# EAGLE design WeatherShield_Base (EAGLE 7.4.0)
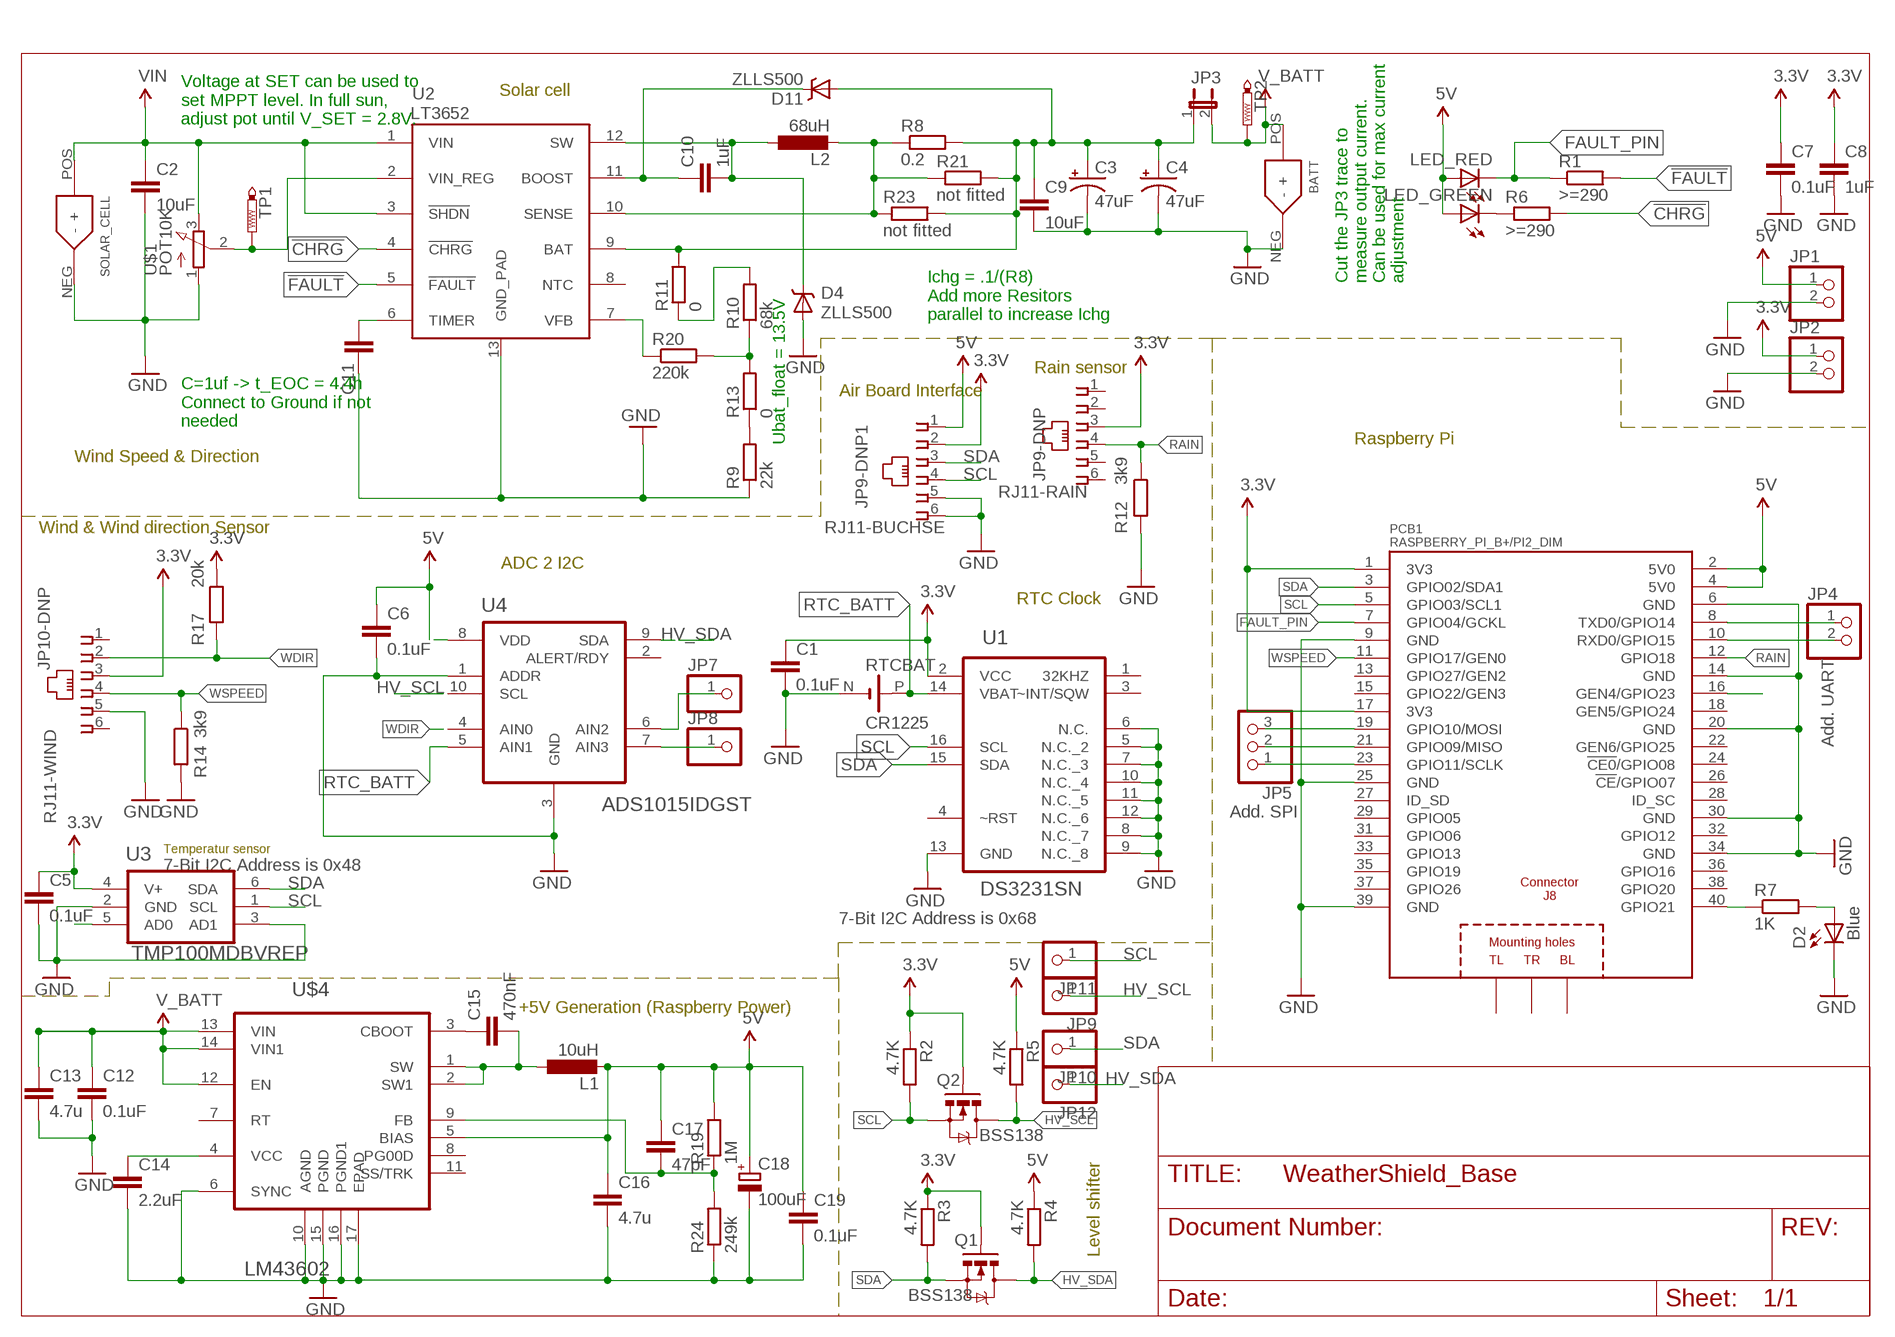
[diagram p0: schematic, sheet 1]

## Parts
BATT  XT-60  [XT-60]
C1  0.1uF  C-EUC0603  [C0603]
C2  10uF  C-EUC0603  [C0603]
C3  47uF  47UF-16V-10%(TANT)  [EIA7343-20]
C4  47uF  47UF-16V-10%(TANT)  [EIA7343-20]
C5  0.1uF  C-EUC0603  [C0603]
C6  0.1uF  C-EUC0603  [C0603]
C7  0.1uF  C-EUC0603  [C0603]
C8  1uF  C-EUC0603  [C0603]
C9  10uF  C-EUC0603  [C0603]
C10  1uF  C-EUC0603  [C0603]
C11  1.0uF  C-EUC0603  [C0603]
C12  0.1uF  C-EUC1206  [C1206]
C13  4.7u  C-EUC1206  [C1206]
C14  2.2uF  C-EUC0603  [C0603]
C15  470nF  C-EUC0603  [C0603]
C16  4.7u  C-EUC0603  [C0603]
C17  47pF  C-EUC0603  [C0603]
C18  100uF  CPOL-EUE2,5-6E  [E2,5-6E]
C19  0.1uF  C-EUC1206  [C1206]
D2  Blue  LED0603  [LED-0603]
D4  ZLLS500  ZLLS500ZLLS500  [SOT23]
D11  ZLLS500  ZLLS500ZLLS500  [SOT23]
JP1  PINHD-1X2  [1X02]
JP2  PINHD-1X2  [1X02]
JP3  JUMPER-PTH-2-NC  [PTH-JUMPER-NC_BOTTOM_NO_SILK]
JP4  PINHD-1X2  [1X02]
JP5  PINHD-1X3  [1X03]
JP7  PINHD-1X1  [1X01]
JP8  PINHD-1X1  [1X01]
JP9  PINHD-1X1  [1X01]
JP9-DNP  RJ11-RAIN  RJ11-BUCHSE  [RJ11-STECKER]
JP9-DNP1  RJ11-BUCHSE  [RJ11-STECKER]
JP10  PINHD-1X1  [1X01]
JP10-DNP  RJ11-WIND  RJ11-BUCHSE  [RJ11-STECKER]
JP11  PINHD-1X1  [1X01]
JP12  PINHD-1X1  [1X01]
L1  10uH  L-EU6000-XXX-RC  [6000-XXXX-RC]
L2  68uH  L-EU6000-XXX-RC  [6000-XXXX-RC]
LED_GREEN  LEDSML0603  [SML0603]
LED_RED  LEDSML0603  [SML0603]
PCB1  RASPBERRY_PI_B+/PI2_DIM  [RASPBERRY_PI_BPLUS_DIM]
Q1  BSS138  MOSFET-NCHANNELSMD  [SOT23-3]
Q2  BSS138  MOSFET-NCHANNELSMD  [SOT23-3]
R1  >=290  R-EU_R0603  [R0603]
R2  4.7K  R-EU_R0603  [R0603]
R3  4.7K  R-EU_R0603  [R0603]
R4  4.7K  R-EU_R0603  [R0603]
R5  4.7K  R-EU_R0603  [R0603]
R6  >=290  R-EU_R0603  [R0603]
R7  1K  R-EU_R0603  [R0603]
R8  0.2  R-EU_R0805  [R0805]
R9  22k  R-EU_R0603  [R0603]
R10  68k  R-EU_R0603  [R0603]
R11  0  R-EU_R0603  [R0603]
R12  3k9  R-EU_R0603  [R0603]
R13  0  R-EU_R0603  [R0603]
R14  3k9  R-EU_R0603  [R0603]
R17  20k  R-EU_R0603  [R0603]
R19  1M  R-EU_R0805  [R0805]
R20  220k  R-EU_R0603  [R0603]
R21  not fitted  R-EU_R0805  [R0805]
R23  not fitted  R-EU_R0805  [R0805]
R24  249k  R-EU_R0805  [R0805]
RTCBAT  CR1225  BATTERIE_HALTER_CR1225  [BATTERIE_HALTER_CR1225]
SOLAR_CELL  XT-60  [XT-60]
TP1  SET  PTR1B1,27  [B1,27]
TP2  SET  PTR1B1,27  [B1,27]
U1  DS3231SN  [SOIC127P1032X265-16N]
U2  LT3652  [MSOP-12_GND]
U3  TMP100MDBVREP  [SOT95P280X145-6N]
U4  ADS1015IDGST  [SOP50P490X110-10N]
U$1  POT10K  POT_TS63Y_10K  [POT_TS63Y_10K]
U$4  LM43602  [HTSSOP-16]

## Nets
3.3V: C1.1 C5.1 C7.1 C8.1 JP2.1 JP9-DNP1.2 JP9-DNP.3 JP10-DNP.3 PCB1.1(3V3) PCB1.17(3V3) Q1.1(G) Q2.1(G) R2.1 R3.1 R17.1 U1.2(VCC) U3.4(V+)
5V: C6.1 C16.1 C17.1 C18.+ C19.1 JP1.1 JP9-DNP1.1 L1.2 LED_GREEN.A LED_RED.A PCB1.2(5V0) PCB1.4(5V0) R4.1 R5.1 R19.2 U4.8(VDD) U$4.5(BIAS)
!CHRG: R6.2 U2.4(!CHRG)
!FAULT: R1.2 U2.5(!FAULT)
BOOST: C10.1 D11.3(C) U2.11(BOOST)
FAULT_PIN: LED_RED.C PCB1.7(GPIO04/GCKL) R1.1
FB: R10.1 R13.2 R20.2
GND [vcc]: BATT.NEG(-) C1.2 C2.2 C3.C(-) C4.C(-) C5.2 C6.2 C7.2 C8.2 C9.2 C11.1 C12.2 C13.2 C14.2 C16.2 C18.- C19.2 D2.C D4.1(A) JP1.2 JP2.2 JP9-DNP1.5 JP9-DNP1.6 JP10-DNP.5 PCB1.6(GND) PCB1.9(GND) PCB1.14(GND) PCB1.20(GND) PCB1.25(GND) PCB1.30(GND) PCB1.34(GND) PCB1.39(GND) R9.1 R12.2 R14.2 R24.1 RTCBAT.N(-) SOLAR_CELL.NEG(-) U1.5(N.C._2) U1.6(N.C.) U1.7(N.C._3) U1.8(N.C._7) U1.9(N.C._8) U1.10(N.C._4) U1.11(N.C._5) U1.12(N.C._6) U1.13(GND) U2.13(GND_PAD) U3.2(GND) U3.3(AD1) U4.1(ADDR) U4.3(GND) U$1.1(A) U$4.6(SYNC) U$4.10(AGND) U$4.15(PGND) U$4.16(PGND1) U$4.17(EPAD)
HV_SCL: JP9.1 Q2.3(D) R5.2 U4.10(SCL)
HV_SDA: JP12.1 Q1.3(D) R4.2 U4.9(SDA)
N$1: R9.2 R13.1
N$2: R10.2 R11.1
N$3: PCB1.16(GEN4/GPIO23)
N$4: LED_GREEN.C R6.1
N$5: U3.5(AD0)
N$8: JP7.1 U4.6(AIN2)
N$9: JP8.1 U4.7(AIN3)
N$10: D2.A R7.2
N$15: R20.1 U2.7(VFB)
N$16: C3.A(+) C4.A(+) C9.1 D11.1(A) JP3.1 R8.2 R11.2 R21.2 R23.2 U2.9(BAT)
N$17: C15.1 U$4.3(CBOOT)
N$18: JP4.1 PCB1.8(TXD0/GPIO14)
N$19: JP4.2 PCB1.10(RXD0/GPIO15)
N$20: JP5.3 PCB1.19(GPIO10/MOSI)
N$21: JP5.2 PCB1.21(GPIO09/MISO)
N$22: C17.2 R19.1 R24.2 U$4.9(FB)
N$23: C14.1 U$4.4(VCC)
N$24: C15.2 L1.1 U$4.1(SW) U$4.2(SW1)
N$25: JP5.1 PCB1.23(GPIO11/SCLK)
RAIN: JP9-DNP.4 PCB1.12(GPIO18) R12.1
RTC_BATT: RTCBAT.P(+) U1.14(VBAT) U4.5(AIN1)
SCL: JP9-DNP1.4 JP11.1 PCB1.5(GPIO03/SCL1) Q2.2(S) R2.2 U1.16(SCL) U3.1(SCL)
SDA: JP9-DNP1.3 JP10.1 PCB1.3(GPIO02/SDA1) Q1.2(S) R3.2 U1.15(SDA) U3.6(SDA)
SENSE: L2.2 R8.1 R21.1 R23.1 U2.10(SENSE)
SET: TP1.TP U2.2(VIN_REG) U$1.2(S)
STAT3: PCB1.40(GPIO21) R7.1
SW: C10.2 D4.3(C) L2.1 U2.12(SW)
TIMER: C11.2 U2.6(TIMER)
V_BATT: BATT.POS(+) C12.1 C13.1 JP3.2 TP2.TP U$4.12(EN) U$4.13(VIN) U$4.14(VIN1)
VIN: C2.1 SOLAR_CELL.POS(+) U2.1(VIN) U2.3(!SHDN) U$1.3(E)
WDIR: JP10-DNP.2 R17.2 U4.4(AIN0)
WSPEED: JP10-DNP.4 PCB1.11(GPIO17/GEN0) R14.1
Unconnected: JP9-DNP.1 JP9-DNP.2 JP9-DNP.5 JP9-DNP.6 JP10-DNP.1 JP10-DNP.6 PCB1.13(GPIO27/GEN2) PCB1.15(GPIO22/GEN3) PCB1.18(GEN5/GPIO24) PCB1.22(GEN6/GPIO25) PCB1.24(!CE0!/GPIO08) PCB1.26(!CE!/GPIO07) PCB1.27(ID_SD) PCB1.28(ID_SC) PCB1.29(GPIO05) PCB1.31(GPIO06) PCB1.32(GPIO12) PCB1.33(GPIO13) PCB1.35(GPIO19) PCB1.36(GPIO16) PCB1.37(GPIO26) PCB1.38(GPIO20) PCB1.PE_BL(BL) PCB1.PE_TL(TL) PCB1.PE_TR(TR) U1.1(32KHZ) U1.3(~INT/SQW) U1.4(~RST) U2.8(NTC) U4.2(ALERT/RDY) U$4.7(RT) U$4.8(PG00D) U$4.11(SS/TRK)

## Notes on the sheet
- Solar cell
- Voltage at SET can be used to
  set MPPT level. In full sun,
  adjust pot until V_SET = 2.8V.
- Cut the JP3 trace to
  measure output current.
  Can be used for max current
  adjustment
- Ichg = .1/(R8)
  Add more Resitors 
  parallel to increase Ichg
- Rain sensor
- Air Board Interface
- C=1uf -> t_EOC = 4.4h
  Connect to Ground if not 
  needed
- Ubat_float = 13.5V | Raspberry Pi
- Wind Speed & Direction
- Wind & Wind direction Sensor
- ADC 2 I2C
- RTC Clock
- Add. UART
- Add. SPI
- Temperatur sensor
- 7-Bit I2C Address is 0x48
- 7-Bit I2C Address is 0x68
- +5V Generation (Raspberry Power)
- Level shifter

## Library data of the parts
BATT SOLAR_CELL = FSEWeatherShield:XT-60
C1 C2 C5-C17 C19 = rcl:C-EU: CAPACITOR, European symbol
C3 C4 = FSEWeatherShield:47UF-16V-10%(TANT)
C18 = rcl:CPOL-EU: POLARIZED CAPACITOR, European symbol
D2 = SparkFun:LED: LEDs Standard schematic elements and footprints for 5mm, 3mm, 1206, and 0603 sized LEDs. 5mm - Spark Fun Electronics SKU : COM-00529 (and others)
D4 D11 = SparkFun-DiscreteSemi:ZLLS500: 700mA 40V SOT-23 Schottky; PROD_ID: DIO-08411
JP1 JP2 JP4 = pinhead:PINHD-1X2: PIN HEADER
JP3 = SparkFun-Passives:JUMPER-PTH-2-NC
JP5 = pinhead:PINHD-1X3: PIN HEADER
JP7-JP12 = pinhead:PINHD-1X1: PIN HEADER
JP9-DNP JP9-DNP1 JP10-DNP = FSEWeatherShield:RJ11-BUCHSE
L1 L2 = rcl:L-EU: INDUCTOR, European symbol
LED_GREEN LED_RED = led:LED: LED OSRAM: - CHIPLED LG R971, LG N971, LY N971, LG Q971, LY Q971, LO R971, LY R971 LH N974, LH R974 LS Q976, LO Q976, LY Q976 LO Q996 - Hyper CHIPLED LW Q18S LB Q993, LB Q99A, LB R99A - SideLED LS A670, LO A670, LY A670, LG A670, LP A670 LB A673, LV A673, LT A673, LW A673 LH A674 LY A675 LS A676, LA A676, LO A676, LY A676, LW A676 LS A679, LY A679, LG A679 - Hyper Micro SIDELED® LS Y876, LA Y876, LO Y876, LY Y876 LT Y87S - SmartLED LW L88C, LW L88S LB L89C, LB L89S, LG L890 LS L89K, LO L89K, LY L89K LS L896, LA L896, LO L896, LY L896 - TOPLED LS T670, LO T670, LY T670, LG T670, LP T670 LSG T670, LSP T670, LSY T670, LOP T670, LYG T670 LG T671, LOG T671, LSG T671 LB T673, LV T673, LT T673, LW T673 LH T674 LS T676, LA T676, LO T676, LY T676, LB T676, LH T676, LSB T676, LW T676 LB T67C, LV T67C, LT T67C, LS T67K, LO T67K, LY T67K, LW E67C LS E67B, LA E67B, LO E67B, LY E67B, LB E67C, LV E67C, LT E67C LW T67C LS T679, LY T679, LG T679 LS T770, LO T770, LY T770, LG T770, LP T770 LB T773, LV T773, LT T773, LW T773 LH T774 LS E675, LA E675, LY E675, LS T675 LS T776, LA T776, LO T776, LY T776, LB T776 LHGB T686 LT T68C, LB T68C - Hyper Mini TOPLED® LB M676 - Mini TOPLED Santana® LG M470 LS M47K, LO M47K, LY M47K Source: http://www.osram.convergy.de LUXEON: - LUMILED® LXK2-PW12-R00, LXK2-PW12-S00, LXK2-PW14-U00, LXK2-PW14-V00 LXK2-PM12-R00, LXK2-PM12-S00, LXK2-PM14-U00 LXK2-PE12-Q00, LXK2-PE12-R00, LXK2-PE12-S00, LXK2-PE14-T00, LXK2-PE14-U00 LXK2-PB12-K00, LXK2-PB12-L00, LXK2-PB12-M00, LXK2-PB14-N00, LXK2-PB14-P00, LXK2-PB14-Q00 LXK2-PR12-L00, LXK2-PR12-M00, LXK2-PR14-Q00, LXK2-PR14-R00 LXK2-PD12-Q00, LXK2-PD12-R00, LXK2-PD12-S00 LXK2-PH12-R00, LXK2-PH12-S00 LXK2-PL12-P00, LXK2-PL12-Q00, LXK2-PL12-R00 Source: www.luxeon.com KINGBRIGHT: KA-3528ASYC Source: www.kingbright.com
PCB1 = FSE_Weather_Shield:RASPBERRY_PI_B+/PI2: Raspberry Pi B+ Basedon issue: Thursday, July 10, 2014 - Rev 1.2 LBR by Tim Rettmann 07-2014
Q1 Q2 = SparkFun:MOSFET-NCHANNEL
R1-R14 R17 R19-R21 R23 R24 = rcl:R-EU_: RESISTOR, European symbol
RTCBAT = FSEWeatherShield:BATTERIE_HALTER_CR1225
TP1 TP2 = testpad:PTR1: TEST PIN
U1 = FSE_Weather_Shield:DS3231SN: Extremely Accurate I2C-Integrated RTC/TCXO/Crystal; MPN: DS3231SN#; OC_FARNELL: 1593292; OC_NEWARK: 68K3406; PACKAGE: SOIC-16; SUPPLIER: Maxim
U2 = SparkFun-PowerIC:LT3652: LT3652 MPPT Solar Charge Controller 5V-32V smart charger for batteries up to 14.4V
U3 = FSEWeatherShield:TMP100MDBVREP: DIGITAL TEMPERATURE SENSOR WITH I2C INTERFACE; MPN: TMP100MDBVREP; OC_FARNELL: 1715202; OC_NEWARK: 46M1069; PACKAGE: SOT-23-6; SUPPLIER: Texas Instruments
U4 = FSEWeatherShield:ADS1015IDGST: Ultra-Small, Low-Power, 12-Bit Analog-to-Digital Converter with Internal Reference; MPN: ADS1015IDGST; OC_FARNELL: 1778211; OC_NEWARK: 35R0211; PACKAGE: MSOP-10; SUPPLIER: Texas Instruments
U$1 = FSEWeatherShield:POT_TS63Y_10K
U$4 = FSEWeatherShield:LM43602

## Net classes
1 vcc: width 0.203 mm

## Board
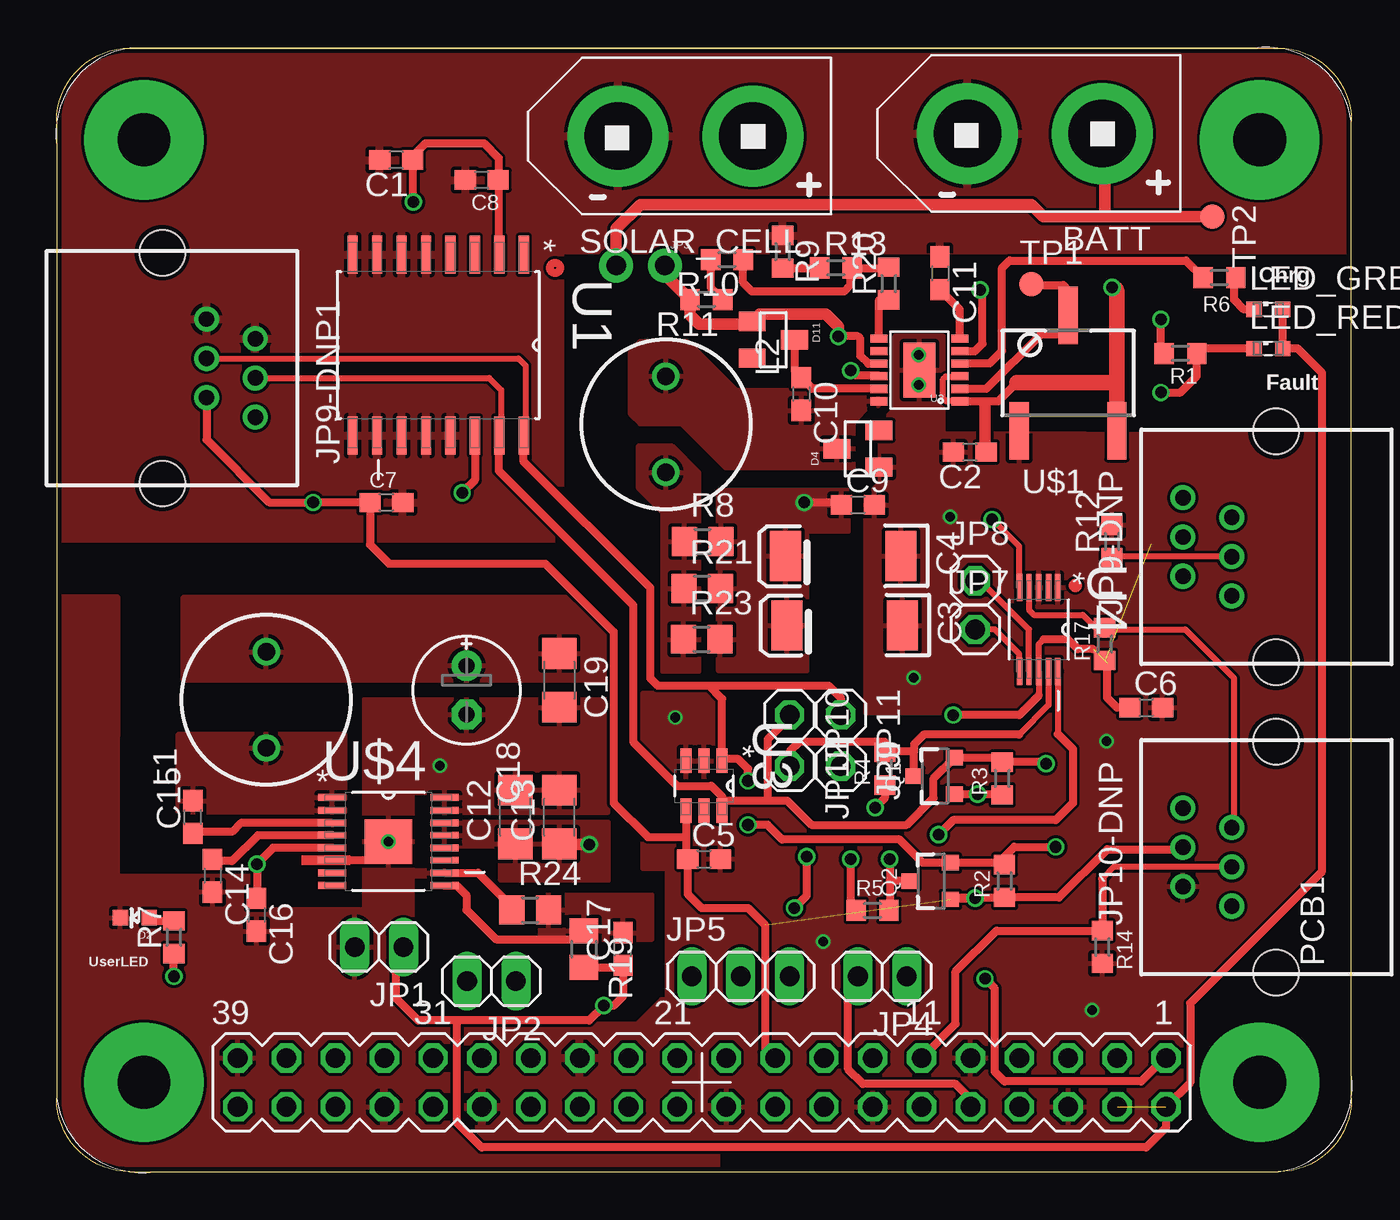
[diagram p1: board, top side]
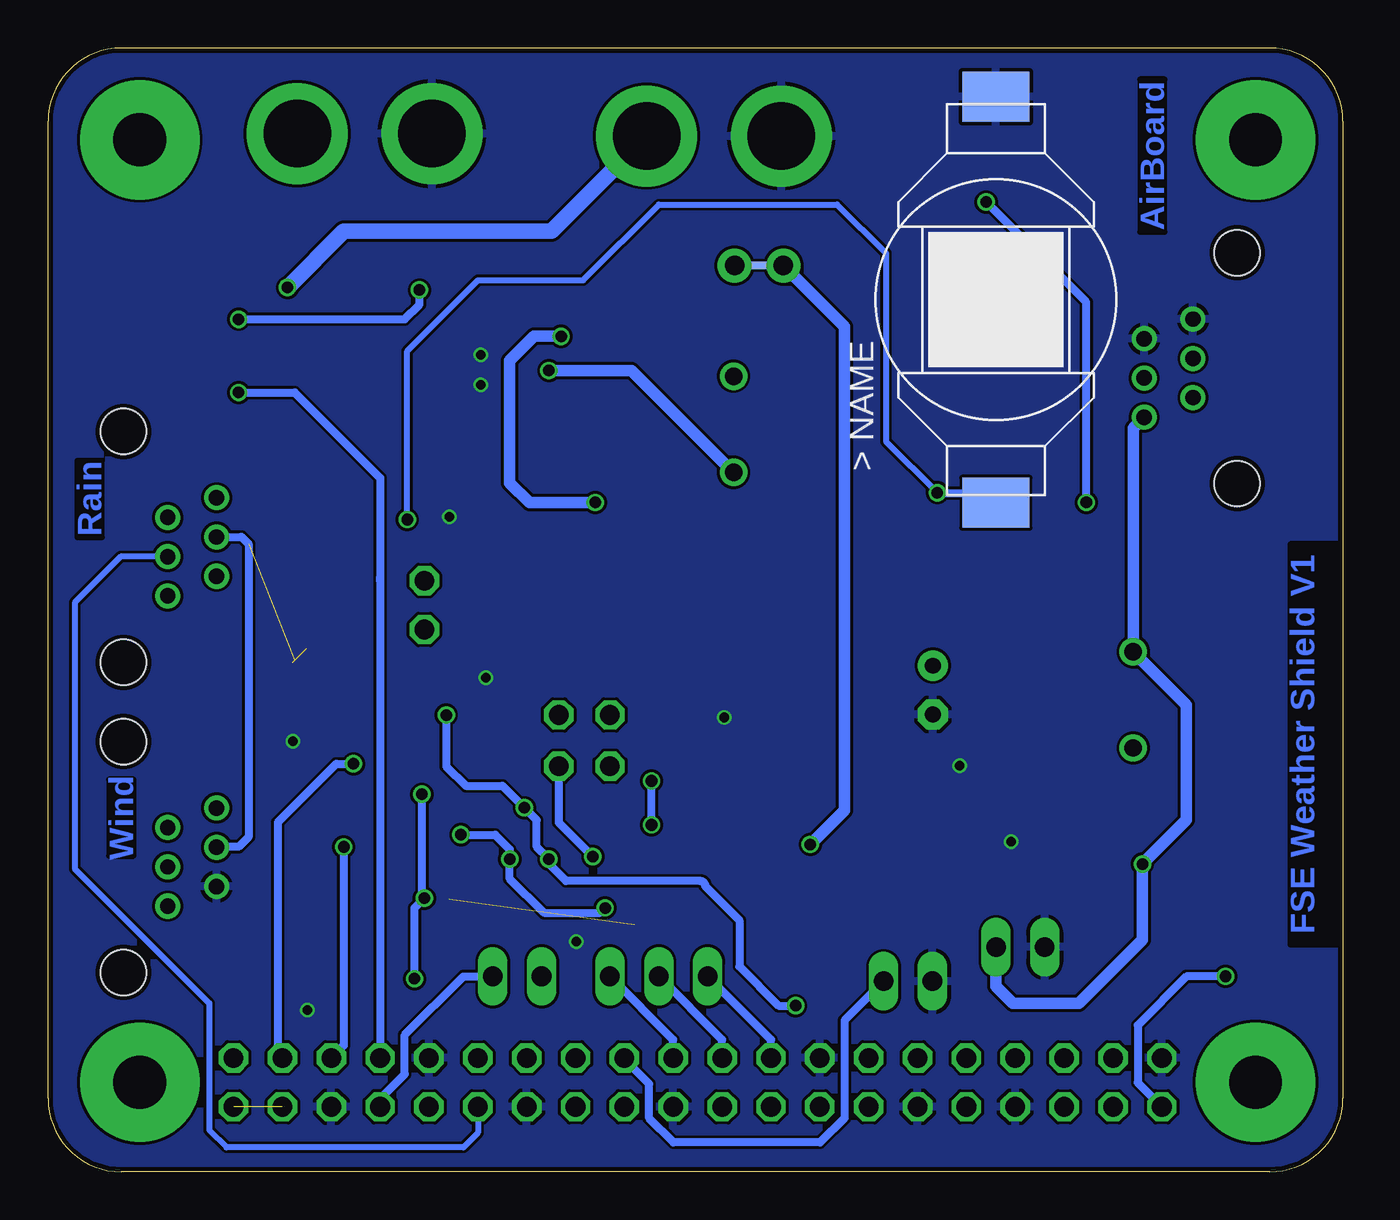
[diagram p2: board, bottom side, seen from below]

Size 67.31 x 58.42 mm. Coordinates in mm from the lower left corner, seen from the top.
Outline: 67.31,3.81 arc-90 63.5,0 3.81,0 arc-90 0,3.81 0,54.61 arc-90 3.81,58.42 63.5,58.42 arc-90 67.31,54.61 67.31,3.81
Copper layers (1*16): Top 0.018mm / dielectric 1.55mm / Bottom 0.018mm
Design rules "eC_2Layer_PClass6_BaseCopperO18_eCDefault": minimum track width 0.15mm, minimum drill 0.35mm, track to track 0.15mm, track to pad 0.15mm, pad to pad 0.15mm, via to via 0.15mm, smd to smd 0mil, copper to edge 0.25mm, drill to drill 0.35mm, minimum pad ring 0.175mm, minimum via ring 0.125mm, stop-mask expansion 0mil, vias tented up to drill 0.45mm, thermal gap 0.2mm

### Footprints (pad centres in the part's own frame; a part is rotated, then mirrored left to right if it is on the bottom)
XT-60 = drill 3.5: NEG 7,0; POS 0,0
C0603 = smd 1.1 x 1: 1 -0.85,0; 2 0.85,0
EIA7343-20 = smd 1.6 x 2.6: A 3,0; C -3,0
C1206 = smd 1.6 x 1.8: 1 -1.4,0; 2 1.4,0
E2,5-6E = drill 0.813 pad 1.575: + -1.27,0 | drill 0.813 pad 1.575 octagon: - 1.27,0
LED-0603 = smd 0.8 x 0.8: A 0,-0.75; C 0,0.75
SOT23 = smd 1 x 1.4: 1 -0.95,-1.1; 2 0.95,-1.1; 3 0,1.1
1X02 = drill 1.016 long: 1 -1.27,0; 2 1.27,0
PTH-JUMPER-NC_BOTTOM_NO_SILK = drill 1.016 pad 1.778: 1 -1.27,0; 2 1.27,0 | smd 1.27 x 0.381 bottom: P$1 0,0
1X03 = drill 1.016 long: 1 -2.54,0; 2 0,0; 3 2.54,0
1X01 = drill 1.016 octagon: 1 0,0
RJ11-STECKER = drill 0.8 pad 1.3: 1 8.65,10.84; 2 7.63,8.3; 3 6.61,10.84; 4 5.59,8.3; 5 4.57,10.84; 6 3.55,8.3 | hole 2.36: 0.1,6; 12.1,6
6000-XXXX-RC = drill 0.9 pad 1.422: 1 -2.5,0; 2 2.5,0
SML0603 = smd 0.8 x 0.8: A 0.75,0; C -0.75,0
RASPBERRY_PI_BPLUS_DIM = drill 1.016 octagon: 1 9.64,52.5; 2 9.64,55.04; 3 12.18,52.5; 4 12.18,55.04; 5 14.72,52.5; 6 14.72,55.04; 7 17.26,52.5; 8 17.26,55.04; 9 19.8,52.5; 10 19.8,55.04; 11 22.34,52.5; 12 22.34,55.04; 13 24.88,52.5; 14 24.88,55.04; 15 27.42,52.5; 16 27.42,55.04; 17 29.96,52.5; 18 29.96,55.04; 19 32.5,52.5; 20 32.5,55.04; 21 35.04,52.5; 22 35.04,55.04; 23 37.58,52.5; 24 37.58,55.04; 25 40.12,52.5; 26 40.12,55.04; 27 42.66,52.5; 28 42.66,55.04; 29 45.2,52.5; 30 45.2,55.04; 31 47.74,52.5; 32 47.74,55.04; 33 50.28,52.5; 34 50.28,55.04; 35 52.82,52.5; 36 52.82,55.04; 37 55.36,52.5; 38 55.36,55.04; 39 57.9,52.5; 40 57.9,55.04 | drill 2.75 pad 6.2: PE_BL 4.77,4.77; PE_TL 4.77,53.77; PE_TR 62.77,53.77; PE_TR1 62.77,4.77
SOT23-3 = smd 0.8 x 0.9: 1 -0.95,-1; 2 0.95,-1; 3 0,1.1
R0603 = smd 1 x 1.1: 1 -0.85,0; 2 0.85,0
R0805 = smd 1.3 x 1.5: 1 -0.95,0; 2 0.95,0
BATTERIE_HALTER_CR1225 = smd 2.6 x 3.5: N 10.55,0; P -10.55,0
B1,27 = smd 1.27 x 1.27: TP 0,0
SOIC127P1032X265-16N = smd 1.981 x 0.533: 1 -4.699,4.445; 2 -4.699,3.175; 3 -4.699,1.905; 4 -4.699,0.635; 5 -4.699,-0.635; 6 -4.699,-1.905; 7 -4.699,-3.175; 8 -4.699,-4.445; 9 4.699,-4.445; 10 4.699,-3.175; 11 4.699,-1.905; 12 4.699,-0.635; 13 4.699,0.635; 14 4.699,1.905; 15 4.699,3.175; 16 4.699,4.445
MSOP-12_GND = smd 0.889 x 0.42: 1 -2.1,1.625; 2 -2.1,0.975; 3 -2.1,0.325; 4 -2.1,-0.325; 5 -2.1,-0.975; 6 -2.1,-1.625; 7 2.1,-1.625; 8 2.1,-0.975; 9 2.1,-0.325; 10 2.1,0.325; 11 2.1,0.975; 12 2.1,1.625 | smd 1.651 x 2.845: 13 0,0
SOT95P280X145-6N = smd 1.27 x 0.559: 1 -1.295,0.94; 2 -1.295,0; 3 -1.295,-0.94; 4 1.295,-0.94; 5 1.295,0; 6 1.295,0.94
SOP50P490X110-10N = smd 1.422 x 0.279: 1 -2.184,0.991; 2 -2.184,0.508; 3 -2.184,0; 4 -2.184,-0.508; 5 -2.184,-0.991; 6 2.184,-0.991; 7 2.184,-0.508; 8 2.184,0; 9 2.184,0.508; 10 2.184,0.991
POT_TS63Y_10K = smd 3 x 1: 1 3,-2.54; 2 -3,0; 3 3,2.54
HTSSOP-16 = smd 1.473 x 0.356: 1 -2.921,2.286; 2 -2.921,1.626; 3 -2.921,0.965; 4 -2.921,0.33; 5 -2.921,-0.33; 6 -2.921,-0.965; 7 -2.921,-1.626; 8 -2.921,-2.286; 9 2.921,-2.286; 10 2.921,-1.626; 11 2.921,-0.965; 12 2.921,-0.33; 13 2.921,0.33; 14 2.921,0.965; 15 2.921,1.626; 16 2.921,2.286 | smd 2.464 x 2.311: 17 0,0

### Placement (x,y rotation side)
BATT  54.36,53.98 180 top
C1  17.65,52.6 180 top
C2  47.47,37.41 180 top
C3  40.97,28.4 180 top
C4  40.89,32 180 top
C5  33.66,16.26 0 top
C6  56.64,24.13 0 top
C7  17.14,34.8 0 top
C8  22.1,51.56 180 top
C9  41.66,34.67 0 top
C10  38.71,40.44 270 top
C11  45.92,46.71 270 top
C12  23.85,18.44 90 top
C13  26.14,18.44 90 top
C14  8.1,15.39 270 top
C15  7.09,18.44 90 top
C16  10.39,13.36 270 top
C17  29.44,11.58 90 top
C18  21.31,25.04 270 top
C19  26.14,25.55 270 top
D2  4.06,13.21 90 top
D4  41.66,37.59 90 top
D11  37.26,43.26 270 top
JP1  16.76,11.68 180 top
JP2  22.61,9.91 180 top
JP3  30.35,47.12 180 top
JP4  42.93,10.16 180 top
JP5  35.56,10.16 0 top
JP7  47.75,28.19 0 top
JP8  47.75,30.73 0 top
JP9  40.77,21.08 270 top
JP9-DNP  69.39,26.39 90 top
JP9-DNP1  -0.51,47.88 270 top
JP10  38.1,23.75 270 top
JP10-DNP  69.39,10.26 90 top
JP11  40.77,23.75 270 top
JP12  38.1,21.08 270 top
L1  10.9,24.54 90 top
L2  31.67,38.86 270 top
LED_GREEN  62.99,44.83 0 top
LED_RED  62.99,42.8 0 top
PCB1  67.31,58.42 180 top
Q1  45.67,20.57 90 top
Q2  45.47,15.11 90 top
R1  58.42,42.55 180 top
R2  49.28,15.11 90 top
R3  49.15,20.45 90 top
R4  43.05,20.95 90 top
R5  42.42,13.59 0 top
R6  60.45,46.48 180 top
R7  6.1,12.19 90 top
R8  33.58,32.77 0 top
R9  37.74,47.83 270 top
R10  34.85,47.42 180 top
R11  33.78,45.34 180 top
R12  54.86,32.77 90 top
R13  40.51,46.99 0 top
R14  54.36,11.68 270 top
R17  54.48,27.43 90 top
R19  27.41,11.58 270 top
R20  43.26,46.18 90 top
R21  33.55,30.33 0 top
R23  33.53,27.69 0 top
R24  24.61,13.61 0 top
RTCBAT  18.03,45.34 90 bottom
SOLAR_CELL  36.2,53.85 180 top
TP1  50.67,46.15 0 top
TP2  60.07,49.66 270 top
U1  19.84,42.98 270 top
U2  44.86,41.68 180 top
U3  33.66,20.07 270 top
U4  51.05,28.19 270 top
U$1  52.58,41.53 270 top
U$4  17.25,17.17 0 top

### Tracks (layer width: path | path; a pad name or v marks a point on that pad's centre or on a via)
3.3V  (via drill 0.6)  (2 unrouted)
  Top 0.406: R3.1 49.12,19.62 v47.88,19.62 Q1.1 | v47.75,14.22 46.65,14.22 Q2.1 46.69,14.26 R2.1 52.11,14.26 54.61,16.76 58.45,16.76 JP10-DNP.3 58.53,16.89 | U3.4 32.72,17.4 | 32.72,17.4 32.72,16.35 C5.1 32.8,14.44 33.53,13.72 35.94,13.72 36.83,12.83 36.83,6.44 PCB1.17 | 32.72,17.4 30.73,17.4 28.96,19.18 28.96,28.07 25.4,31.62 17.27,31.62 16.29,32.6 C7.1 v13.34,34.8 11.05,34.8 7.79,38.05 JP9-DNP1.2 | U1.2 23.01,51.56 C8.1 22.99,51.6 22.99,52.7 22.22,53.47 19.18,53.47 18.5,52.79 C1.1 18.54,52.56 v18.54,50.42 | PCB1.1 57.61,5.92 56.39,4.7 49.28,4.7 48.77,5.21 48.77,9.53 v48.26,10.03
  Bottom 0.406: JP2.1 25.91,7.87 25.91,2.79 27.18,1.52 34.8,1.52 36.07,2.79 36.07,4.57 37.35,5.85 PCB1.17 | v47.88,19.62 47.88,14.35 v47.75,14.22 48.26,13.72 v48.26,10.03 | v13.34,34.8 13.34,45.21 v18.54,50.42 | JP9-DNP.3 57.26,33 56.9,32.64 56.9,17.4 57.4,16.89 58.53,16.89 JP10-DNP.3
5V  (via drill 0.6)  (2 unrouted)
  Top 0.305: 51.31,27.69 51.05,27.43 U4.8 51.05,24.77
  Top 0.406: R19.2 29.34,10.63 C17.1 29.44,9.12 28.96,8.64 v28.45,8.64 27.69,7.87 20.83,7.87 | U$4.5 11.25,16.84 v10.41,16 10.41,14.24 C16.1 | 20.83,7.87 18.8,7.87 17.65,9.02 17.65,11.3 JP1.1 | 20.83,7.87 20.83,2.54 22.1,1.27 56.64,1.27 57.67,2.3 PCB1.2 58.93,4.64 58.93,8.76 65.79,15.62 65.79,41.53 64.52,42.8 LED_RED.A LED_GREEN.A | C6.1 55.12,24.13 54.61,24.64 54.61,26.45 | 53.89,27.18 53.09,27.18 52.58,27.69 51.31,27.69 | 51.05,24.77 50.04,23.75 v46.61,23.75 | R4.1 43.05,19.43 v42.55,18.92 | v41.28,16.26 41.28,13.88 R5.1
  Bottom 0.406: 10.78,26.92 L1.2 | v28.45,8.64 29.34,8.64 31.37,10.67 31.37,13.08 33.15,14.86 arc-90 33.4,15.11 40.39,15.11 41.28,16 v41.28,16.26 41.91,16.89 41.91,18.29 v42.55,18.92 43.69,20.07 45.59,20.07 46.61,21.08 v46.61,23.75
  Bottom 0.61: JP9-DNP1.1 10.9,38.66 L1.2 10.9,27.03 8.13,24.26 8.13,18.29 v10.41,16 10.41,12.06 13.72,8.76 17.14,8.76 18.03,9.65 JP1.1
  pour Top: 28.68,25.55 6.58,25.55 6.58,29.87 28.68,29.87
!CHRG
  Top 0.406: U2.4 46.99,42.04 48.51,42.04 49.15,42.67 49.15,46.99 49.53,47.37 58.71,47.37 R6.2
!FAULT  (via drill 0.6)
  Top 0.406: U2.5 47.74,42.66 48.13,43.05 48.13,45.72 v48.01,45.85 | R1.2 57.4,42.71 v57.4,44.32
  Bottom 0.406: v57.4,44.32 48.77,44.32 48.01,45.09 v48.01,45.85
BOOST
  Top 0.406: U2.11 39.29,40.71 C10.1 38.36,41.63 D11.3
FAULT_PIN  (via drill 0.6)
  Top 0.406: v57.4,40.51 58.42,40.51 59.27,41.36 R1.1 | R1.1 59.46,42.74 | LED_RED.C 59.52,42.8 R1.1
  Bottom 0.406: 50.05,30.87 50.05,30.73 | 50.05,30.73 PCB1.7 | 50.05,30.73 50.04,30.75 50.04,36.07 54.48,40.51 v57.4,40.51
FB
  Top 0.406: R20.2 43.22,46.99 R13.2 41.28,46.9 41.28,46.1 40.95,45.77 36.14,45.77 35.69,46.23 R10.1
GND  (via drill 0.5 pad 0.25)
  Top 0.406: U$4.6 16.79,16.2 17.25,16.66 U$4.17 | U$4.10 21.92,15.54 23.66,13.8 R24.1
  other vias: 17.25,17.17 19.91,21.11 44.81,40.92 53.82,8.41 44.55,25.68 54.58,22.38 32.16,23.62 44.81,42.47 46.46,34.06 39.85,11.96
  pour Bottom: 0,0 0,58.42 67.31,58.42 67.31,0
  pour Top: 19.53,18.69 28.68,18.69 28.68,24.54 15.98,24.54 15.98,13.61 10.64,13.61 10.77,15.39 3.17,15.37 3.2,29.87 0.23,29.87 0.23,-0.23 18.52,-0.23 18.52,15.39 19.53,15.39 19.53,15.65 18.52,15.65 18.52,19.71 19.53,19.71
  pour Top: 46.1,43.43 43.56,43.43 43.56,39.62 42.8,38.86 42.8,35.81 42.04,35.05 42.04,23.88 53.59,23.88 53.47,27.43 53.47,38.35 46.1,38.35
  pour Top: 30.48,24.89 51.05,24.89 51.05,34.8 53.09,34.8 53.09,38.35 67.31,38.35 67.06,0 31.75,0 31.75,15.75 30.48,15.75
  pour Top: 17.02,7.62 30.23,7.62 31.5,8.89 34.29,8.89 34.29,0.25 17.02,0.25
  pour Top: 67.31,58.55 67.31,47.88 26.16,47.88 26.16,32.89 0,32.89 0,58.55
HV_SCL  (via drill 0.6)
  Top 0.305: 52.07,26.01 U4.10 52.05,22.76 | 43.31,13.63 R5.2
  Top 0.406: 52.05,22.76 52.83,21.97 52.83,19.18 51.94,18.29 46.61,18.29 v45.85,17.53 | v43.31,16.26 43.31,15.11 | 43.31,15.11 43.31,13.63 | Q2.3 43.31,15.11 | v38.99,16.38 38.99,14.35 v38.35,13.72
  Bottom 0.406: v45.85,17.53 44.07,17.53 43.31,16.76 v43.31,16.26 43.31,15.24 41.53,13.46 38.61,13.46 v38.35,13.72 | JP9.1 40.77,18.16 v38.99,16.38
HV_SDA
  Top 0.305: U4.9 51.56,24.26 50.04,22.73 | Q1.3 44.58,20.58 44.58,21.84 44.57,21.84 | 43.09,21.84 R4.2
  Top 0.406: 50.04,22.73 45.09,22.73 44.58,22.23 44.58,21.84 43.09,21.84 | Q1.3 44.57,21.84 | R4.2 43.05,22.35 38.61,22.35 38.1,21.84 JP12.1
N$1
  Top 0.406: R9.2 39.65,46.98 R13.1
N$2
  Top 0.406: R10.2 34,45.97 R11.1
N$4
  Top 0.406: LED_GREEN.C 61.72,44.83 61.21,45.34 61.21,46.39 R6.1
N$8
  Top 0.305: U4.6 50.04,26.04 50.04,26.92 48.77,28.19 JP7.1
N$9
  Top 0.305: U4.7 50.55,28.19 48.01,30.73 JP8.1
N$10
  Top 0.406: D2.A 4.81,13.04 R7.2
N$15
  Top 0.406: U2.7 42.76,45.33 R20.1
N$16  (via drill 0.6)
  Top 0.406: 36.53,44.58 D11.1 36.03,44.07 | C9.1 40.81,34.8 v38.86,34.8 | U2.9 42.2,42.01 41.78,42.42 41.78,43.31 41.66,43.43 v40.64,43.43
  Top 0.61: 36.53,44.58 40.01,44.58 40.64,43.94 v40.64,43.43 | JP3.1 31.62,46.65 R11.2 32.93,44.54 33.4,44.07 36.03,44.07
  Bottom 0.61: v40.64,43.43 42.04,43.43 43.31,42.16 43.31,35.81 42.29,34.8 v38.86,34.8
  pour Top: 38.99,26.04 34.42,26.04 34.42,35.43 41.15,35.43 41.15,33.27 38.99,33.27
N$17
  Top 0.406: U$4.3 9.58,18.14 9.12,17.68 7.18,17.68 C15.1
N$18
  Bottom 0.406: PCB1.8 50.05,3.8 48.77,5.08 48.77,7.11 45.72,10.16 JP4.1
N$19
  Top 0.406: PCB1.10 47.51,3.8 46.74,4.57 41.91,4.57 41.15,5.33 41.15,9.65 JP4.2
N$20
  Bottom 0.406: PCB1.19 34.81,6.87 JP5.3
N$21
  Bottom 0.406: PCB1.21 32.27,6.87 JP5.2
N$22
  Top 0.406: 25.63,13.55 R24.2 | U$4.9 20.8,14.88 21.31,14.38 21.31,13.61 22.83,12.09 26.96,12.09 R19.1
  pour Top: 25.12,14.38 25.12,12.09 30.96,12.09 30.96,14.38
N$23
  Top 0.406: U$4.4 10.46,17.5 9.12,16.15 8.19,16.15 C14.1
N$24
  pour Top: 14.96,18.69 6.32,18.69 6.32,22.76 14.96,22.76
N$25
  Bottom 0.406: PCB1.23 29.73,6.87 JP5.1
RAIN
  Top 0.305: JP9-DNP.4 54.93,31.98 R12.1
  Bottom 0.305: PCB1.12 44.96,3.37 44.96,2.03 45.72,1.27 58.04,1.27 58.93,2.16 58.93,8.76 65.91,15.75 65.91,29.59 63.52,31.98 JP9-DNP.4
RTC_BATT  (via drill 0.6)
  Top 0.305: U4.5 50.04,30.38 50.04,32.51 v48.64,33.91
  Top 0.406: U1.14 21.74,35.97 v21.08,35.31
  Bottom 0.305: v48.64,33.91 48.64,42.67 44.96,46.35 39.5,46.35 35.56,50.29 26.29,50.29 23.75,47.75 23.75,37.97 v21.08,35.31
  Bottom 0.406: RTCBAT.P 18.54,35.3 21.08,35.3 v21.08,35.31
SCL  (via drill 0.6)
  Top 0.305: JP9-DNP1.4 24,42.29 24.38,41.91 24.38,38.38 U1.16
  Top 0.406: U1.16 24.26,38.25 24.26,36.96 30.86,30.35 30.86,25.65 31.24,25.27 33.91,25.27 | v35.94,20.32 35.94,20.95 35.43,21.46 34.7,21.46 U3.1 34.59,24.59 33.91,25.27 | v35.94,18.03 36.96,18.03 37.72,17.27 43.82,17.27 45.02,16.06 Q2.2 49.18,16.06 R2.2 49.28,16.38 49.78,16.89 v51.94,16.89 | 40.77,24 JP11.1 40.77,24.64 40.13,25.27 33.91,25.27
  Bottom 0.406: v35.94,18.03 v35.94,20.32 | v51.94,16.89 51.94,6.57 PCB1.5
SDA  (via drill 0.6)
  Top 0.305: JP9-DNP1.3 22.48,41.27 23.11,40.64 23.11,38.38 U1.15
  Top 0.406: v51.44,21.21 51.35,21.3 R3.2 48.92,21.52 Q1.2 45.59,20.45 45.59,19.43 44.2,18.03 39.24,18.03 37.97,19.3 36.96,19.3 | U1.15 22.99,38.25 22.99,36.45 29.97,29.46 29.97,22.35 32.26,20.07 34.04,20.07 34.59,19.51 34.59,19.36 | 34.59,19.36 U3.6 | 34.59,19.36 34.54,19.3 36.96,19.3 | JP10.1 37.72,23.75 37.72,23.24 36.96,22.48 36.96,19.3
  Bottom 0.406: v51.44,21.21 52.32,21.21 55.37,18.16 55.37,6.16 PCB1.3
SENSE  (via drill 0.6)
  Top 0.406: U2.10 42.71,41.4 41.53,41.4 v41.28,41.66
  Bottom 0.61: v41.28,41.66 36.97,41.66 L2.2
  pour Top: 33.4,26.04 33.4,36.32 32,37.72 30.23,37.72 30.23,35.56 31.5,34.29 31.5,26.04
SET
  Top 0.406: 50.72,46.1 52.32,46.1 52.58,45.85 U$1.2 52.58,43.69 52.45,43.56 51.18,43.56 48.33,40.71 U2.2
  Top 0.813: 50.72,46.1 TP1.TP
STAT3  (via drill 0.6)
  Top 0.406: v6.1,10.16 R7.1
  Bottom 0.406: v6.1,10.16 8.13,10.16 10.67,7.62 10.67,4.64 PCB1.40
SW
  pour Top: 42.7,39.83 42.24,39.83 41.4,38.99 41.4,36.58 34.8,36.58 32.51,38.86 30.35,38.86 29.84,39.37 29.84,42.67 30.35,43.18 32.77,43.18 35.31,40.64 41.28,40.64 41.66,40.26 42.67,40.26 42.67,39.88
TIMER
  Top 0.406: U2.6 46.96,44.83 C11.2
V_BATT  (via drill 0.6)
  Top 0.61: v27.69,17.02 26.16,17.02 C13.1 | JP3.2 29.08,49.02 30.35,50.29 50.67,50.29 51.31,49.66 54.48,49.66 | 54.48,49.66 TP2.TP | BATT.POS 54.48,53.85 54.48,49.66
  Bottom 0.61: v27.69,17.02 25.91,18.8 25.91,43.94 JP3.2
  pour Top: 19.53,18.19 28.68,18.19 28.68,15.14 23.09,15.14 23.09,16.92 19.53,16.92
VIN  (via drill 0.6)
  Top 0.305: U2.1 46.25,40.06 46.08,40.23 46.08,41.2 46.23,41.35 U2.3
  Top 0.406: 47.19,40.06 U2.1 48.13,40.06 | 48.13,40.06 48.95,40.06 49.91,41.02 | 48.26,39.93 48.13,40.06 | U2.3
  Top 0.61: C2.1 48.26,37.48 48.26,39.93
  Top 0.813: U$1.3 55.12,41.02 | 55.12,41.02 55.12,45.72 arc90 v54.86,45.97 | 49.91,41.02 55.12,41.02
  Bottom 0.813: v54.86,45.97 51.94,48.9 41.15,48.9 SOLAR_CELL.POS
WDIR
  Top 0.305: JP10-DNP.2 61.21,18.01 61.21,25.65 58.67,28.19 54.48,28.19 R17.2 54.01,28.28 53.34,28.96 50.8,28.96 50.55,29.21 U4.4
WSPEED
  Top 0.305: JP10-DNP.4 54.97,15.85 54.36,15.24
  Top 0.406: 54.36,15.24 R14.1 48.86,12.53 46.74,10.41 46.74,7.69 PCB1.11
(copper drawn outside any net)
  shapes: Top area x1, Top circle x2

### Text on the board
Bottom: AirBoard | Rain | FSE Weather Shield V1 | Wind
tPlace: Chrg | Fault | UserLED
tValues: N. Seidle